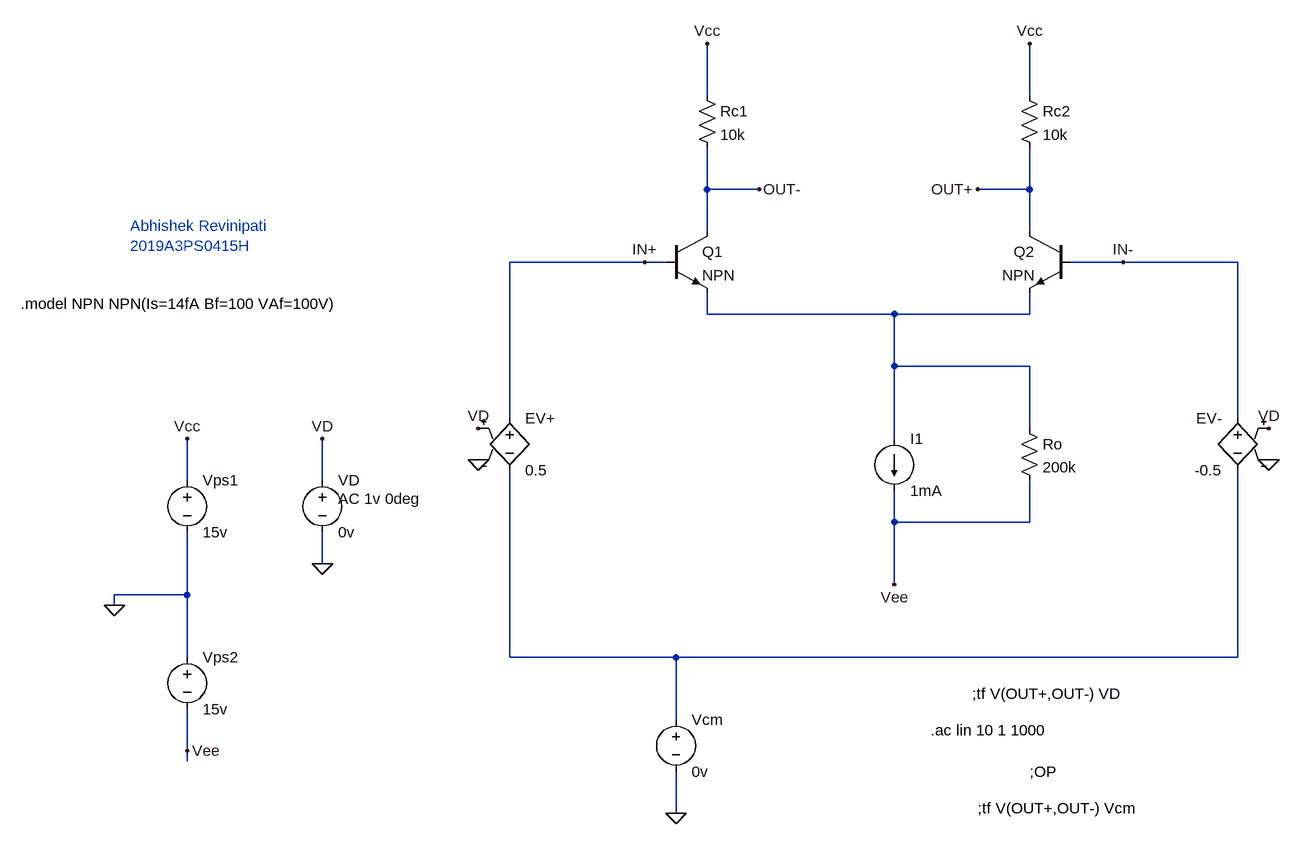
[diagram p0: schematic 2019A3PS0415H_exp9.asc]
2019A3PS0415H_exp9.asc, the LTspice schematic file:
Version 4
SHEET 1 4056 824
WIRE 656 -672 656 -752
WIRE 1152 -672 1152 -752
WIRE 656 -528 656 -592
WIRE 736 -528 656 -528
WIRE 1152 -528 1152 -592
WIRE 1152 -528 1072 -528
WIRE 656 -464 656 -528
WIRE 1152 -464 1152 -528
WIRE 560 -416 352 -416
WIRE 592 -416 560 -416
WIRE 1296 -416 1216 -416
WIRE 1472 -416 1296 -416
WIRE 656 -336 656 -368
WIRE 944 -336 656 -336
WIRE 1152 -336 1152 -368
WIRE 1152 -336 944 -336
WIRE 944 -256 944 -336
WIRE 1152 -256 944 -256
WIRE 352 -176 352 -416
WIRE 1472 -176 1472 -416
WIRE 1152 -160 1152 -256
WIRE 944 -144 944 -256
WIRE -144 -80 -144 -144
WIRE 64 -80 64 -144
WIRE 944 -16 944 -64
WIRE 1152 -16 1152 -80
WIRE 1152 -16 944 -16
WIRE 64 48 64 0
WIRE 944 80 944 -16
WIRE -144 96 -144 0
WIRE -144 96 -256 96
WIRE -256 112 -256 96
WIRE -144 192 -144 96
WIRE 352 192 352 -96
WIRE 608 192 352 192
WIRE 1472 192 1472 -96
WIRE 1472 192 608 192
WIRE 608 288 608 192
WIRE -144 336 -144 272
WIRE -144 352 -144 336
WIRE 608 432 608 368
FLAG -256 112 0
FLAG 64 48 0
FLAG 1152 -752 Vcc
FLAG 656 -752 Vcc
FLAG -144 -144 Vcc
FLAG 64 -144 VD
FLAG 608 432 0
FLAG -144 336 Vee
FLAG 944 80 Vee
FLAG 736 -528 OUT-
FLAG 1072 -528 OUT+
FLAG 1296 -416 IN-
FLAG 304 -160 VD
FLAG 1520 -160 VD
FLAG 304 -112 0
FLAG 1520 -112 0
FLAG 560 -416 IN+
SYMBOL voltage -144 -96 R0
WINDOW 123 0 0 Left 0
WINDOW 39 0 0 Left 0
SYMATTR InstName Vps1
SYMATTR Value 15v
SYMBOL voltage 64 -96 R0
WINDOW 123 24 44 Left 2
WINDOW 39 0 0 Left 0
SYMATTR Value2 AC 1v 0deg
SYMATTR InstName VD
SYMATTR Value 0v
SYMBOL voltage 608 272 R0
WINDOW 123 0 0 Left 0
WINDOW 39 0 0 Left 0
SYMATTR InstName Vcm
SYMATTR Value 0v
SYMBOL voltage -144 176 R0
WINDOW 123 0 0 Left 0
WINDOW 39 0 0 Left 0
SYMATTR InstName Vps2
SYMATTR Value 15v
SYMBOL current 944 -144 R0
WINDOW 123 0 0 Left 0
WINDOW 39 0 0 Left 0
SYMATTR InstName I1
SYMATTR Value 1mA
SYMBOL npn 592 -464 R0
SYMATTR InstName Q1
SYMBOL npn 1216 -464 M0
SYMATTR InstName Q2
SYMBOL res 1136 -688 R0
SYMATTR InstName Rc2
SYMATTR Value 10k
SYMBOL res 640 -688 R0
SYMATTR InstName Rc1
SYMATTR Value 10k
SYMBOL e 352 -192 R0
SYMATTR InstName EV+
SYMATTR Value 0.5
SYMBOL e 1472 -192 M0
SYMATTR InstName EV-
SYMATTR Value -0.5
SYMBOL res 1136 -176 R0
SYMATTR InstName Ro
SYMATTR Value 200k
TEXT -400 -352 Left 2 !.model NPN NPN(Is=14fA Bf=100 VAf=100V)
TEXT 1064 248 Left 2 !;tf V(OUT+,OUT-) VD
TEXT 1152 368 Left 2 !;OP
TEXT 1072 424 Left 2 !;tf V(OUT+,OUT-) Vcm
TEXT -232 -472 Left 2 ;Abhishek Revinipati \n2019A3PS0415H
TEXT 1000 304 Left 2 !.ac lin 10 1 1000

The netlist it stands for:
* 2019A3PS0415H_exp9.asc
Vps1 Vcc 0 15v
VD VD 0 0v AC 1v 0deg
Vcm N002 0 0v
Vps2 0 Vee 15v
I1 N001 Vee 1mA
Q1 OUT- IN+ N001 0 NPN
Q2 OUT+ IN- N001 0 NPN
Rc2 Vcc OUT+ 10k
Rc1 Vcc OUT- 10k
EV+ IN+ N002 VD 0 0.5
EV- IN- N002 VD 0 -0.5
Ro N001 Vee 200k
.model NPN NPN
.model PNP PNP
.lib standard.bjt
.model NPN NPN(Is=14fA Bf=100 VAf=100V)
;tf V(OUT+,OUT-) VD
;OP
;tf V(OUT+,OUT-) Vcm
* Abhishek Revinipati
* 2019A3PS0415H
.ac lin 10 1 1000
.backanno
.end